# EAGLE design Turnout Decoder V1.1Hall (EAGLE 8.2.2)
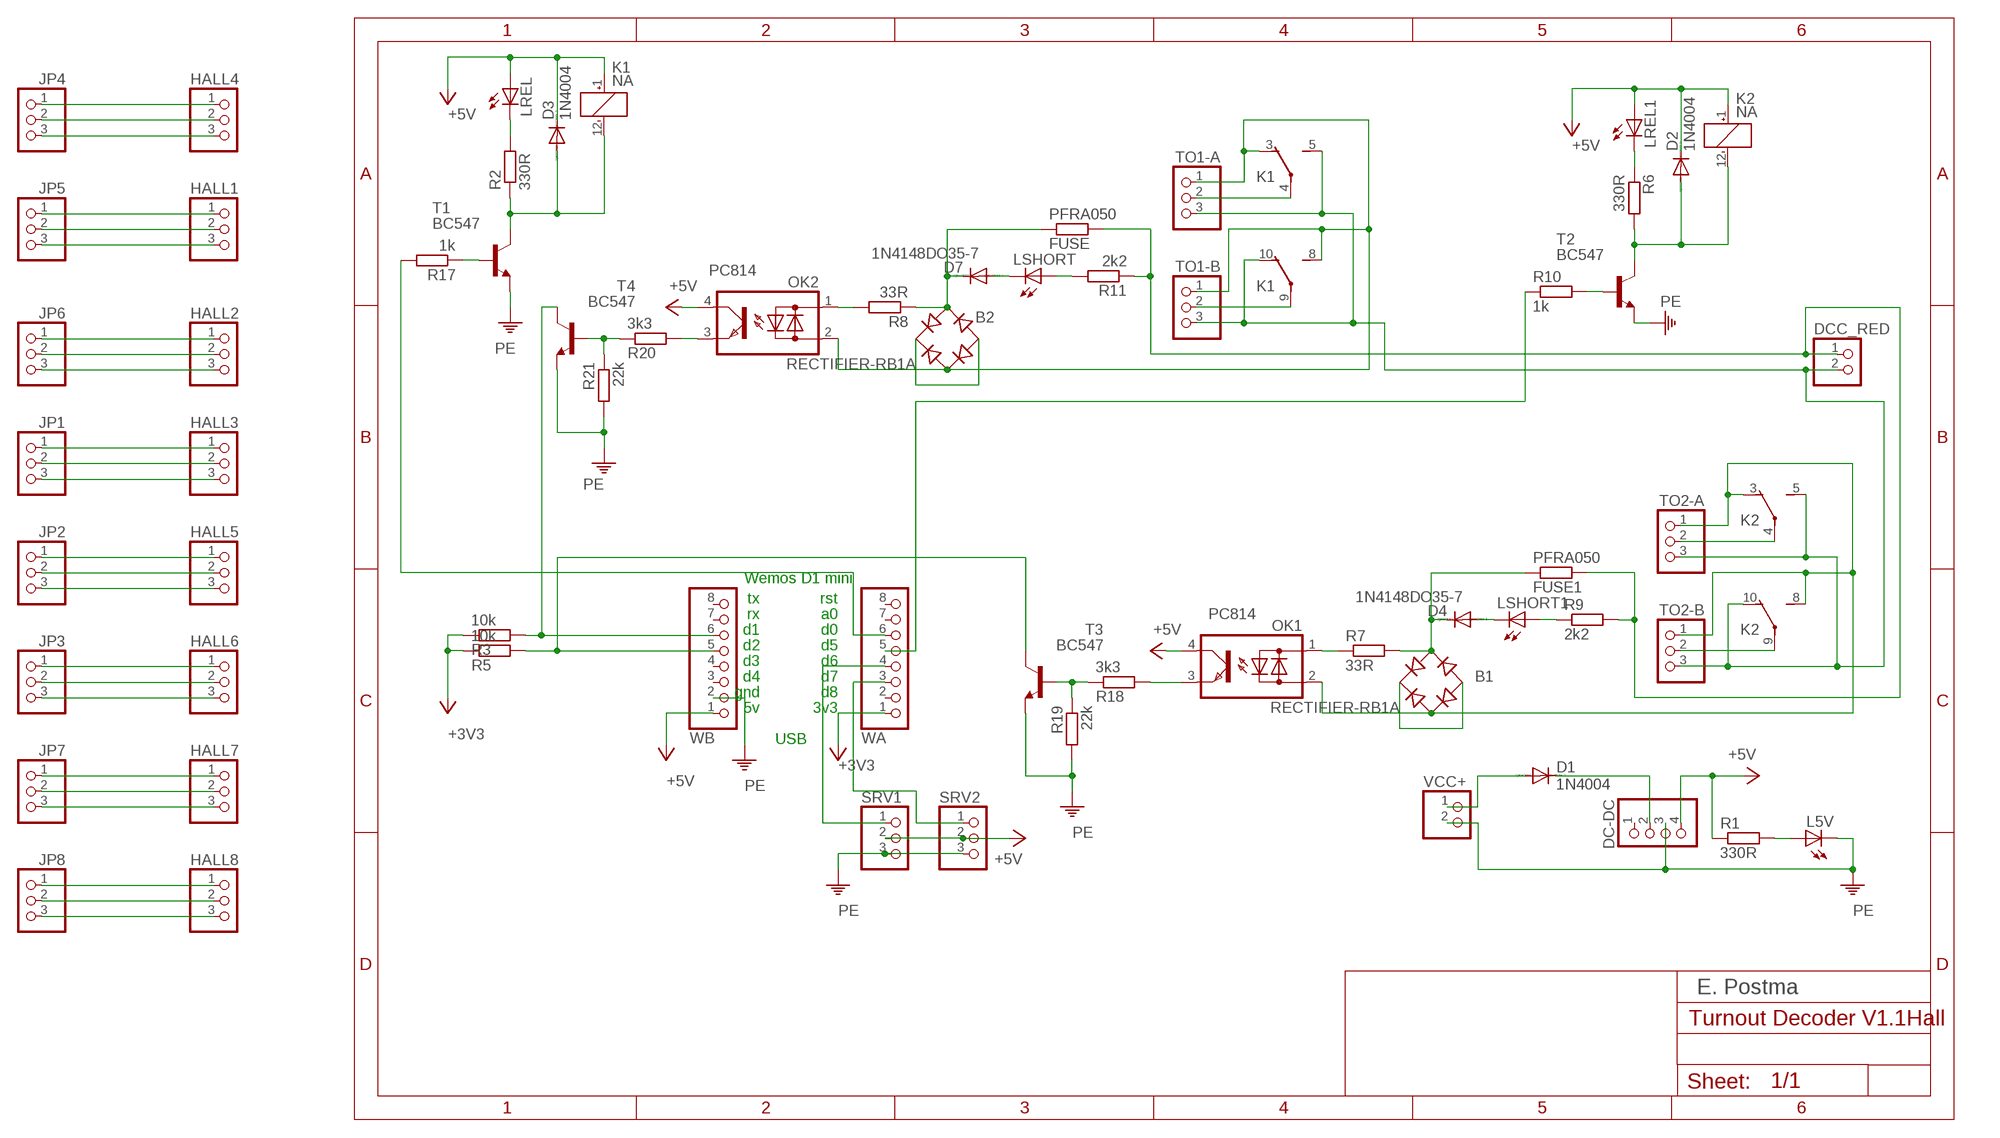
[diagram p0: schematic, sheet 1]

## Parts
B1  RECTIFIER-RB1A  [RB1A]
B2  RECTIFIER-RB1A  [RB1A]
D1  1N4004  [DO41-10]
D2  1N4004  [DO41-10]
D3  1N4004  [DO41-10]
D4  1N4148DO35-7  [DO35-7]
D7  1N4148DO35-7  [DO35-7]
DC-DC  PINHD-1X4  [1X04]
DCC_RED  PINHD-1X2  [1X02]
FUSE  PFRA050  R-EU_0414/5V  [0414V]
FUSE1  PFRA050  R-EU_0414/5V  [0414V]
HALL1  PINHD-1X3  [1X03]
HALL2  PINHD-1X3  [1X03]
HALL3  PINHD-1X3  [1X03]
HALL4  PINHD-1X3  [1X03]
HALL5  PINHD-1X3  [1X03]
HALL6  PINHD-1X3  [1X03]
HALL7  PINHD-1X3  [1X03]
HALL8  PINHD-1X3  [1X03]
JP1  PINHD-1X3  [1X03]
JP2  PINHD-1X3  [1X03]
JP3  PINHD-1X3  [1X03]
JP4  PINHD-1X3  [1X03]
JP5  PINHD-1X3  [1X03]
JP6  PINHD-1X3  [1X03]
JP7  PINHD-1X3  [1X03]
JP8  PINHD-1X3  [1X03]
K1  NA  [NA]
K2  NA  [NA]
L5V  LED3MM  [LED3MM]
LREL  LED3MM  [LED3MM]
LREL1  LED3MM  [LED3MM]
LSHORT  LED3MM  [LED3MM]
LSHORT1  LED3MM  [LED3MM]
OK1  PC814  [DIL04]
OK2  PC814  [DIL04]
R1  330R  R-EU_0207/7  [0207/7]
R2  330R  R-EU_0207/7  [0207/7]
R3  10k  R-EU_0207/7  [0207/7]
R5  10k  R-EU_0207/7  [0207/7]
R6  330R  R-EU_0207/7  [0207/7]
R7  33R  R-EU_0207/7  [0207/7]
R8  33R  R-EU_0207/7  [0207/7]
R9  2k2  R-EU_0207/7  [0207/7]
R10  1k  R-EU_0207/7  [0207/7]
R11  2k2  R-EU_0207/7  [0207/7]
R17  1k  R-EU_0207/7  [0207/7]
R18  3k3  R-EU_0207/7  [0207/7]
R19  22k  R-EU_0207/7  [0207/7]
R20  3k3  R-EU_0207/7  [0207/7]
R21  22k  R-EU_0207/7  [0207/7]
SRV1  PINHD-1X3  [1X03]
SRV2  PINHD-1X3  [1X03]
T1  BC547  [TO92]
T2  BC547  [TO92]
T3  BC547  [TO92]
T4  BC547  [TO92]
TO1-A  PINHD-1X3  [1X03]
TO1-B  PINHD-1X3  [1X03]
TO2-A  PINHD-1X3  [1X03]
TO2-B  PINHD-1X3  [1X03]
VCC+  PINHD-1X2  [1X02]
WA  PINHD-1X8  [1X08]
WB  PINHD-1X8  [1X08]

## Nets
+3V3 [3.3V]: R3.1 R5.1 WA.1
+5V [5V]: D2.C D3.C DC-DC.4 K1.1(1:+) K2.1(1:+) LREL1.A LREL.A OK1.4(C) OK2.4(C) R1.1 SRV1.2 SRV2.2 WB.1
N$1: HALL1.2 JP5.2
N$2: LREL1.K(C) R6.1
N$3 [Rijstroom+]: DCC_RED.1 FUSE1.2 FUSE.2 R9.2 R11.1
N$4 [5V]: D1.A VCC+.1
N$5: OK1.1(AC1) R7.1
N$6: LSHORT1.A R9.1
N$7: D4.A LSHORT1.K(C)
N$8: D2.A K2.12(1:-) R6.2 T2.3(C)
N$9: R10.2 T2.2(B)
N$10 [Rijstroom+]: B1.+ B1.-
N$11: OK1.3(E) R18.2
N$12: LREL.K(C) R2.2
N$13 [Rijstroom+]: K2.4(2:P) TO2-A.2
N$14 [Rijstroom+]: B2.AC2 K1.3(2:O) K1.8(3:S) OK2.2(AC2) TO1-A.1 TO1-B.1
N$15 [Rijstroom-]: K2.9(3:P) TO2-B.2
N$16 [Rijstroom-]: DCC_RED.2 K1.5(2:S) K1.10(3:O) K2.5(2:S) K2.10(3:O) TO1-A.3 TO1-B.3 TO2-A.3 TO2-B.3
N$17: OK2.3(E) R20.2
N$18 [Rijstroom+]: B1.AC2 K2.3(2:O) K2.8(3:S) OK1.2(AC2) TO2-A.1 TO2-B.1
N$19: R3.2 T4.3(C) WB.6
N$20 [Rijstroom+]: B1.AC1 D4.C FUSE1.1 R7.2
N$21: OK2.1(AC1) R8.2
N$22: R5.2 T3.3(C) WB.5
N$23 [Rijstroom+]: B2.AC1 D7.C FUSE.1 R8.1
N$24: HALL1.1 JP5.1
N$25: HALL1.3 JP5.3
N$26 [Rijstroom+]: K1.4(2:P) TO1-A.2
N$27: R18.1 R19.1 T3.2(B)
N$28: R20.1 R21.1 T4.2(B)
N$29: R17.2 WA.6
N$30: HALL2.2 JP6.2
N$31: SRV1.1 WA.4
N$32 [Rijstroom-]: K1.9(3:P) TO1-B.2
N$33: SRV2.1 WA.3
N$34: R10.1 WA.5
N$35: LSHORT.A R11.2
N$36: HALL2.1 JP6.1
N$37: HALL2.3 JP6.3
N$38: HALL3.2 JP1.2
N$39: HALL3.1 JP1.1
N$40: HALL3.3 JP1.3
N$41: D7.A LSHORT.K(C)
N$42 [Rijstroom+]: B2.+ B2.-
N$43: HALL5.2 JP2.2
N$44: HALL5.1 JP2.1
N$45: HALL5.3 JP2.3
N$46: L5V.A R1.2
N$47: HALL6.2 JP3.2
N$48: HALL6.1 JP3.1
N$49: R17.1 T1.2(B)
N$50: D3.A K1.12(1:-) R2.1 T1.3(C)
N$51: HALL6.3 JP3.3
N$52: HALL7.2 JP7.2
N$53: HALL7.1 JP7.1
N$54: HALL7.3 JP7.3
N$55: HALL4.2 JP4.2
N$56: HALL4.3 JP4.3
N$57: HALL4.1 JP4.1
N$58 [5V]: D1.C DC-DC.2
N$59: HALL8.2 JP8.2
N$60: HALL8.1 JP8.1
N$61: HALL8.3 JP8.3
PE [Gnd]: DC-DC.3 L5V.K(C) R19.2 R21.2 SRV1.3 SRV2.3 T1.1(E) T2.1(E) T3.1(E) T4.1(E) VCC+.2 WB.2
Unconnected: DC-DC.1 WA.2 WA.7 WA.8 WB.3 WB.4 WB.7 WB.8

## Notes on the sheet
- Wemos D1 mini
- tx | rst
- rx | a0
- d1 | d0
- d2 | d5
- d3 | d6
- d4 | d7
- gnd | d8
- 5v | 3v3
- USB
- E. Postma

## Library data of the parts
B1 B2 = rectifier:RECTIFIER-: Rectifier
D1-D3 = diode:1N4004: DIODE general purpose rectifier, 1 A
D4 D7 = diode:1N4148: DIODE high speed (Philips)
DC-DC = pinhead:PINHD-1X4: PIN HEADER
DCC_RED VCC+ = pinhead:PINHD-1X2: PIN HEADER
FUSE FUSE1 R1-R3 R5-R11 R17-R21 = resistor:R-EU_: RESISTOR, European symbol
HALL1-HALL8 JP1-JP8 SRV1 SRV2 TO1-A TO1-B TO2-A TO2-B = pinhead:PINHD-1X3: PIN HEADER
K1 K2 = relay:NA: RELAY; OC_FARNELL: unknown; OC_NEWARK: unknown
L5V LREL LREL1 LSHORT LSHORT1 = led:LED: LED OSRAM: - CHIPLED LG R971, LG N971, LY N971, LG Q971, LY Q971, LO R971, LY R971 LH N974, LH R974 LS Q976, LO Q976, LY Q976 LO Q996 - Hyper CHIPLED LW Q18S LB Q993, LB Q99A, LB R99A - SideLED LS A670, LO A670, LY A670, LG A670, LP A670 LB A673, LV A673, LT A673, LW A673 LH A674 LY A675 LS A676, LA A676, LO A676, LY A676, LW A676 LS A679, LY A679, LG A679 - Hyper Micro SIDELED® LS Y876, LA Y876, LO Y876, LY Y876 LT Y87S - SmartLED LW L88C, LW L88S LB L89C, LB L89S, LG L890 LS L89K, LO L89K, LY L89K LS L896, LA L896, LO L896, LY L896 - TOPLED LS T670, LO T670, LY T670, LG T670, LP T670 LSG T670, LSP T670, LSY T670, LOP T670, LYG T670 LG T671, LOG T671, LSG T671 LB T673, LV T673, LT T673, LW T673 LH T674 LS T676, LA T676, LO T676, LY T676, LB T676, LH T676, LSB T676, LW T676 LB T67C, LV T67C, LT T67C, LS T67K, LO T67K, LY T67K, LW E67C LS E67B, LA E67B, LO E67B, LY E67B, LB E67C, LV E67C, LT E67C LW T67C LS T679, LY T679, LG T679 LS T770, LO T770, LY T770, LG T770, LP T770 LB T773, LV T773, LT T773, LW T773 LH T774 LS E675, LA E675, LY E675, LS T675 LS T776, LA T776, LO T776, LY T776, LB T776 LHGB T686 LT T68C, LB T68C - Hyper Mini TOPLED® LB M676 - Mini TOPLED Santana® LG M470 LS M47K, LO M47K, LY M47K Source: http://www.osram.convergy.de LUXEON: - LUMILED® LXK2-PW12-R00, LXK2-PW12-S00, LXK2-PW14-U00, LXK2-PW14-V00 LXK2-PM12-R00, LXK2-PM12-S00, LXK2-PM14-U00 LXK2-PE12-Q00, LXK2-PE12-R00, LXK2-PE12-S00, LXK2-PE14-T00, LXK2-PE14-U00 LXK2-PB12-K00, LXK2-PB12-L00, LXK2-PB12-M00, LXK2-PB14-N00, LXK2-PB14-P00, LXK2-PB14-Q00 LXK2-PR12-L00, LXK2-PR12-M00, LXK2-PR14-Q00, LXK2-PR14-R00 LXK2-PD12-Q00, LXK2-PD12-R00, LXK2-PD12-S00 LXK2-PH12-R00, LXK2-PH12-S00 LXK2-PL12-P00, LXK2-PL12-Q00, LXK2-PL12-R00 Source: www.luxeon.com KINGBRIGHT: KA-3528ASYC Source: www.kingbright.com
OK1 OK2 = optocoupler:PC814: SHARP OPTO COUPLER; OC_FARNELL: 9707662; OC_NEWARK: unknown
T1-T4 = transistor:BC547: NPN TRANSISTOR
WA WB = pinhead:PINHD-1X8: PIN HEADER

## Net classes
0 default: width 0.635 mm, clearance 0.254 mm
1 5V: width 0.762 mm, clearance 0.254 mm
2 Gnd: width 0.762 mm, clearance 0.254 mm
3 Extra: width 1.016 mm, clearance 0.254 mm
4 Rijstroom+: width 1.016 mm, clearance 0.254 mm
5 3.3V: width 0.508 mm, clearance 0.254 mm
6 Rijstroom-: width 1.016 mm, clearance 0.254 mm

## Board
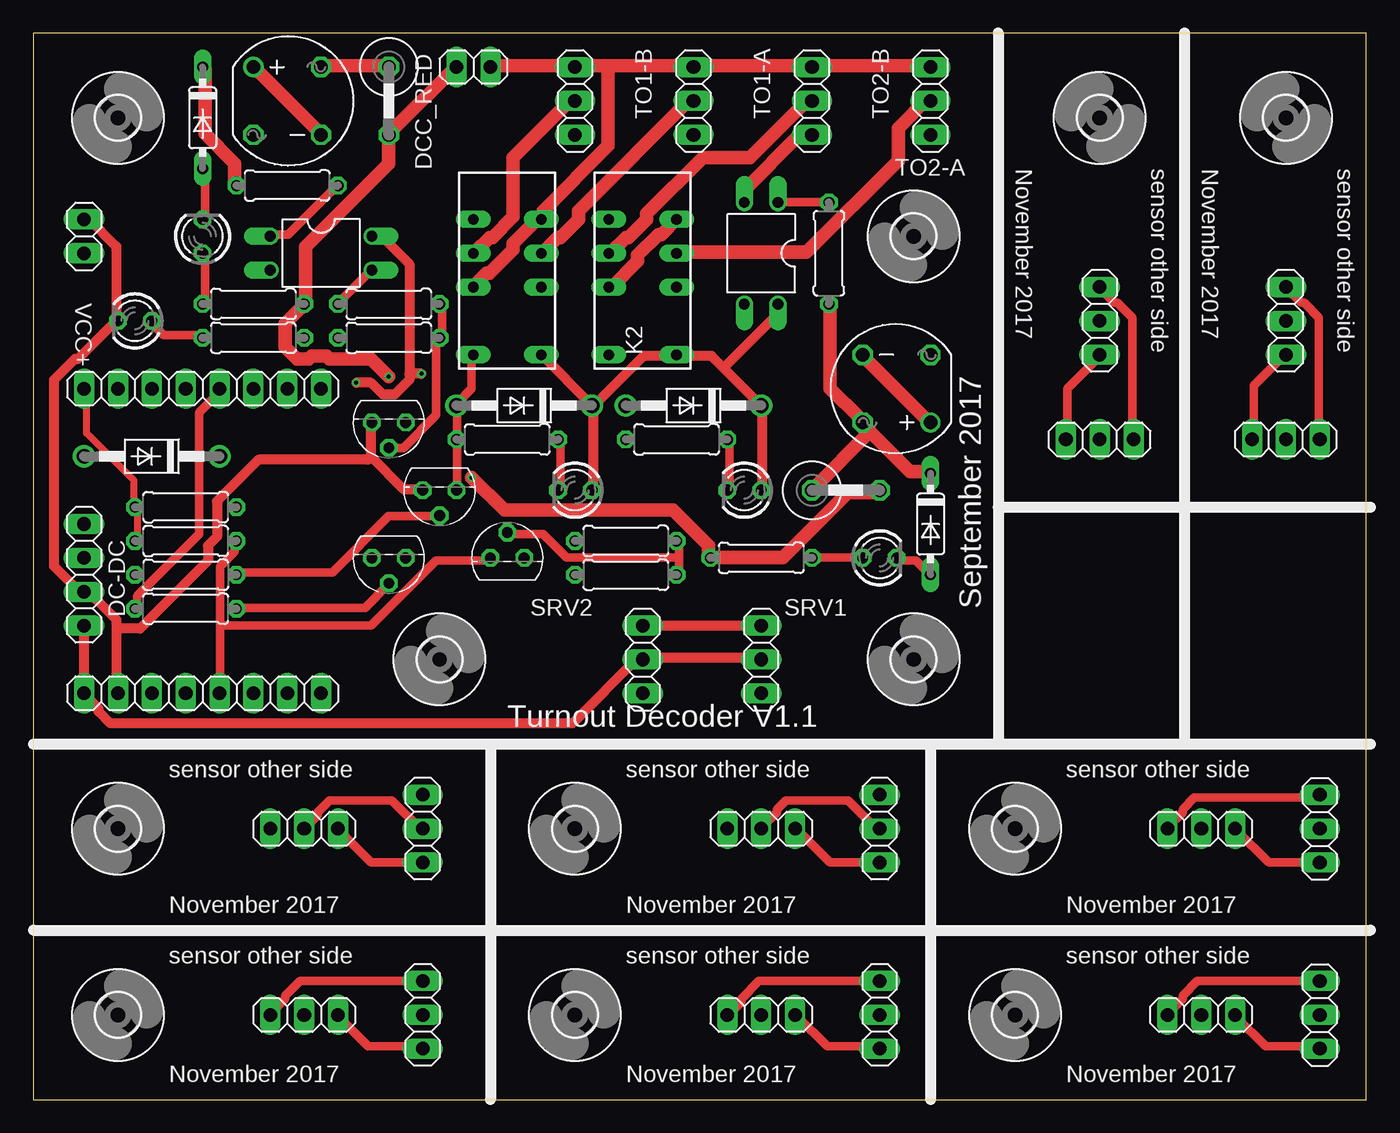
[diagram p1: board, top side]
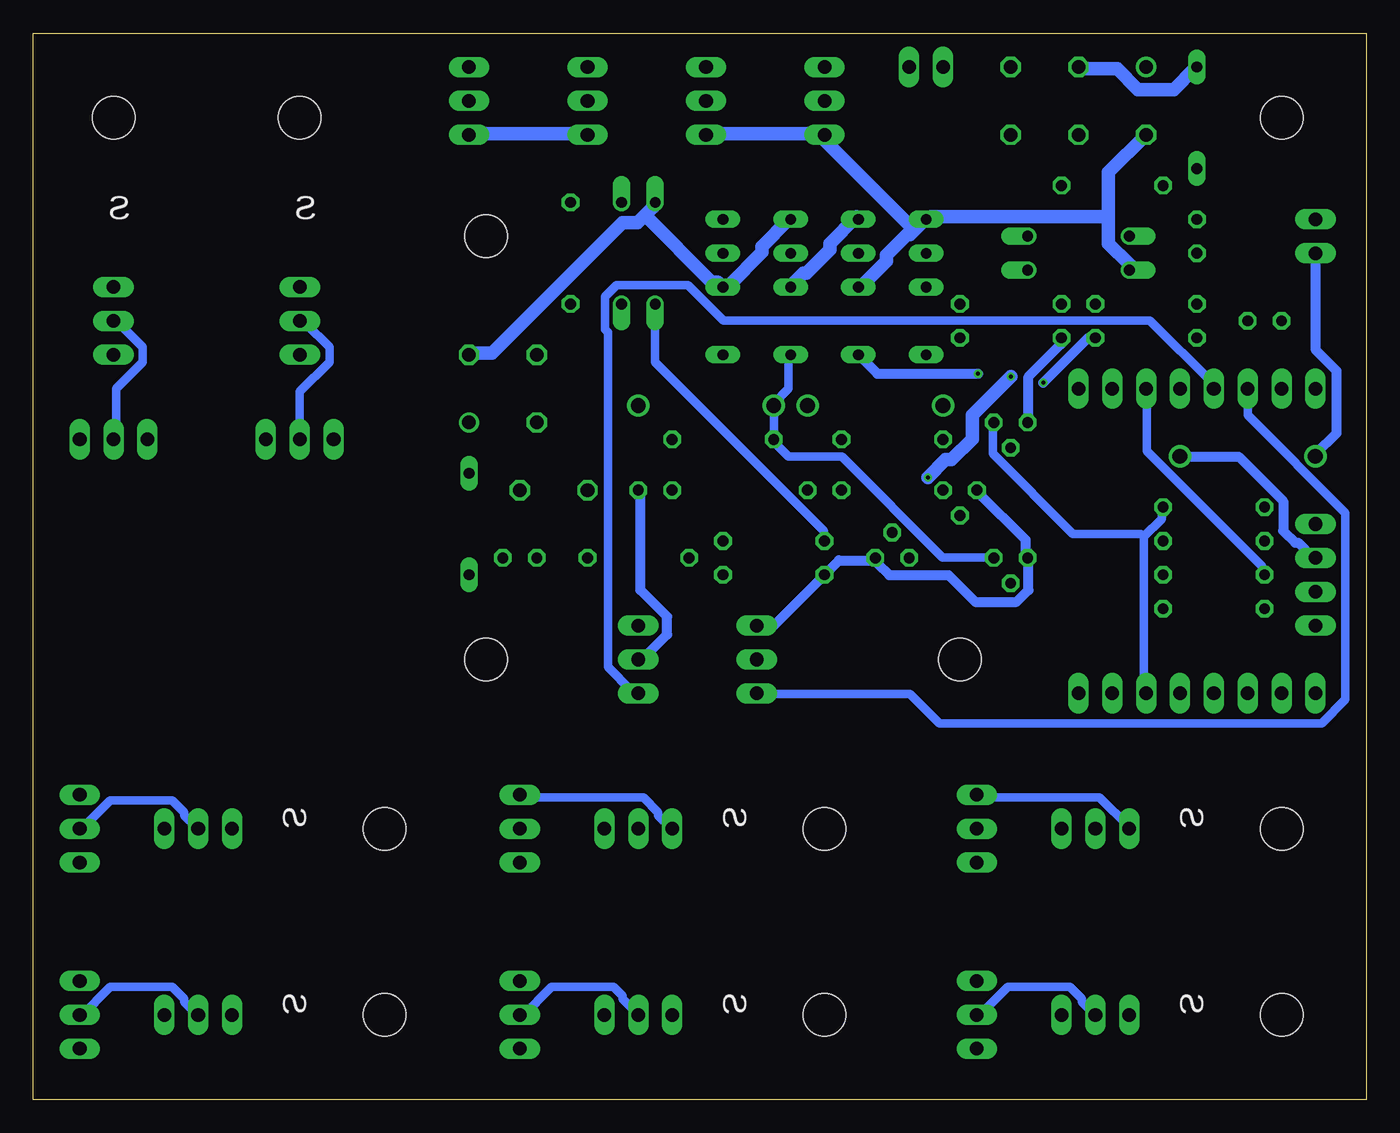
[diagram p2: board, bottom side, seen from below]

Size 100 x 80 mm. Coordinates in mm from the lower left corner, seen from the top.
Outline: 0,0 100,0 100,80 0,80 0,0
Copper layers (1*16): Top 0.035mm / dielectric 1.5mm / Bottom 0.035mm
Design rules "NOA Eagle Rule 2016-06-12": minimum track width 6mil, minimum drill 0.3mm, track to track 6mil, track to pad 6mil, pad to pad 6mil, via to via 6mil, smd to smd 0mil, copper to edge 0.4mm, drill to drill 10mil, minimum pad ring 10mil, minimum via ring 6mil, stop-mask expansion 2mil, vias tented up to drill 25mil, thermal gap 10mil
tRestrict: 1 lines
bRestrict: 1 lines

### Footprints (pad centres in the part's own frame; a part is rotated, then mirrored left to right if it is on the bottom)
RB1A = drill 1.016: + -2.54,2.54 | drill 1.016 octagon: - 2.54,-2.54; AC1 2.54,2.54; AC2 -2.54,-2.54
DO41-10 = drill 1.118: A 5.08,0; C -5.08,0
DO35-7 = drill 0.813 long: A 3.81,0; C -3.81,0
1X04 = drill 1.016 long: 1 -3.81,0; 2 -1.27,0; 3 1.27,0; 4 3.81,0
1X02 = drill 1.016 long: 1 -1.27,0; 2 1.27,0
0414V = drill 1.016 octagon: 1 -2.54,0; 2 2.54,0
1X03 = drill 1.016 long: 1 -2.54,0; 2 0,0; 3 2.54,0
NA = drill 0.8 long: 1 -6.35,-2.54; 3 -1.27,-2.54; 4 1.27,-2.54; 5 3.81,-2.54; 8 3.81,2.54; 9 1.27,2.54; 10 -1.27,2.54; 12 -6.35,2.54
LED3MM = drill 0.813 octagon: A -1.27,0; K 1.27,0
DIL04 = drill 0.813 offset: 1 -1.27,-3.81; 2 1.27,-3.81; 3 1.27,3.81; 4 -1.27,3.81
0207/7 = drill 0.813 octagon: 1 -3.81,0; 2 3.81,0
TO92 = drill 0.813 octagon: 1 1.27,0; 2 0,1.905; 3 -1.27,0
3,2 = hole 3.2: 0,0
1X08 = drill 1.016 long: 1 -8.89,0; 2 -6.35,0; 3 -3.81,0; 4 -1.27,0; 5 1.27,0; 6 3.81,0; 7 6.35,0; 8 8.89,0

### Placement (x,y rotation side)
B1  64.77,53.34 180 top
B2  19.05,74.93 0 top
D1  8.89,48.26 180 top
D2  49.53,52.07 180 top
D3  36.83,52.07 180 top
D4  67.31,43.18 270 top
D7  12.7,73.66 270 top
DC-DC  3.81,39.37 270 top
DCC_RED  33.02,77.47 0 top
FUSE  26.67,74.93 270 top
FUSE1  60.96,45.72 0 top
HALL1  20.32,20.32 0 top
HALL2  93.98,58.42 270 top
HALL3  20.32,6.35 0 top
HALL4  80.01,58.42 270 top
HALL5  54.61,20.32 0 top
HALL6  54.61,6.35 0 top
HALL7  87.63,20.32 180 top
HALL8  87.63,6.35 180 top
JP1  29.21,6.35 270 top
JP2  63.5,20.32 270 top
JP3  63.5,6.35 270 top
JP4  80.01,49.53 180 top
JP5  29.21,20.32 270 top
JP6  93.98,49.53 180 top
JP7  96.52,20.32 90 top
JP8  96.52,6.35 90 top
K1  35.56,62.23 90 top
K2  45.72,62.23 90 top
L5V  7.62,58.42 180 top
LREL  40.64,45.72 180 top
LREL1  53.34,45.72 180 top
LSHORT  12.7,64.77 90 top
LSHORT1  63.5,40.64 0 top
OK1  54.61,63.5 180 top
OK2  21.59,63.5 270 top
R1  16.51,57.15 180 top
R2  35.56,49.53 0 top
R3  11.43,44.45 0 top
R5  11.43,41.91 0 top
R6  48.26,49.53 180 top
R7  59.69,63.5 270 top
R8  19.05,68.58 0 top
R9  54.61,40.64 180 top
R10  11.43,36.83 0 top
R11  16.51,59.69 180 top
R17  11.43,39.37 180 top
R18  44.45,41.91 180 top
R19  44.45,39.37 180 top
R20  26.67,59.69 180 top
R21  26.67,57.15 180 top
SRV1  54.61,33.02 90 top
SRV2  45.72,33.02 90 top
T1  30.48,45.72 180 top
T2  26.67,40.64 180 top
T3  35.56,40.64 0 top
T4  26.67,50.8 180 top
TO1-A  49.53,74.93 90 top
TO1-B  40.64,74.93 90 top
TO2-A  67.31,74.93 90 top
TO2-B  58.42,74.93 90 top
U$1  [3,2]  6.35,73.66 0 top
U$2  [3,2]  66.04,64.77 0 top
U$3  [3,2]  30.48,33.02 0 top
U$4  [3,2]  66.04,33.02 0 top
U$5  [3,2]  73.66,20.32 0 top
U$6  [3,2]  6.35,20.32 0 top
U$7  [3,2]  73.66,6.35 0 top
U$11  [3,2]  80.01,73.66 270 top
U$12  [3,2]  93.98,73.66 270 top
U$14  [3,2]  6.35,6.35 0 top
U$15  [3,2]  40.64,20.32 0 top
U$16  [3,2]  40.64,6.35 0 top
VCC+  3.81,64.77 90 top
WA  12.7,53.34 0 top
WB  12.7,30.48 0 top

### Tracks (layer width: path | path; a pad name or v marks a point on that pad's centre or on a via)
+3V3
  Top 0.508: R5.1 7.78,42.01 7.78,44.45 R3.1 7.56,44.67 7.56,46.45 4,50.01 4,53.34 WA.1
+5V  (via drill 0.3)
  Top 0.762: v24.23,53.78 25.34,53.78 26.23,52.9 27.11,52.9 28.23,54.01 28.23,54.45 | 28.23,54.45 28.23,62.67 26.23,64.67 25.56,64.67 OK2.4 | K1.1 38.23,55.78 41.78,52.23 D3.C | LREL.A 42.01,45.78 42.01,51.78 D3.C | 51.78,54.9 D2.C 54.67,51.78 54.67,45.78 LREL1.A | 51.78,54.9 50.9,55.78 48.45,55.78 K2.1 48.01,55.78 45.78,55.78 42.23,52.23 D3.C | 51.78,54.9 55.78,58.9 55.78,59.56 OK1.4 | v29.11,54.45 28.23,54.45 | DC-DC.4 3.78,35.56 3.78,30.67 WB.1 4,30.23 4.89,29.34 4.89,29.11 5.78,28.23 40.45,28.23 45.34,33.12 SRV2.2 45.78,33.12 54.45,33.12 SRV1.2
  Bottom 0.762: v24.23,53.78 20.89,57.12 20.45,57.12 R1.1 | v29.11,54.45 36.67,54.45 K1.1 | LREL1.A 54.45,45.56 54.45,38.23 52.45,36.23 52.45,34.89 54.45,32.89 SRV1.2
N$1
  Top 0.635: HALL1.2 21.34,21.34 21.34,21.56 22.23,22.45 26.89,22.45 29.11,20.23 JP5.2
N$2
  Top 0.635: LREL1.K 52.23,45.78 52.23,49.34 R6.1
N$3  (via drill 0.3)
  Top 1.016: FUSE1.2 63.34,45.56 61.12,45.56 56.23,40.67 50.9,40.67 R9.2 50.67,41.12 50.67,41.56 48.01,44.23 35.34,44.23 v32.89,46.67 | DCC_RED.1 31.56,77.34 26.89,72.68 FUSE.2 26.67,70.23 20.45,64.01 20.45,59.78 R11.1 20,59.34 18.89,58.23 18.89,56.45 19.78,55.56 20.67,55.56 20.89,55.78 22,55.78 22.23,55.56 25.34,55.56 v26.67,54.23
  Bottom 1.016: v32.89,46.67 31.56,48.01 31.11,48.01 29.56,49.56 29.56,51.34 v26.67,54.23
N$4
  Bottom 0.762: VCC+.1 3.78,63.34 3.78,56.23 2.22,54.67 2.22,50.01 3.78,48.45 D1.A
N$5
  Top 0.635: OK1.1 56.01,67.34 59.56,67.34 R7.1
N$6
  Top 0.635: R9.1 58.45,40.67 62.23,40.67 LSHORT1.A
N$7
  Top 0.635: D4.A 66.23,40.45 64.9,40.45 LSHORT1.K
N$8
  Bottom 0.635: K2.12 43.34,55.78 43.34,53.34 44.45,52.23 D2.A R6.2 44.45,49.34 43.34,48.23 39.34,48.23 31.78,40.67 28,40.67 T2.3
N$9
  Top 0.635: R10.2 15.34,36.89 24.89,36.89 26.67,38.67 T2.2
N$10
  Top 1.016: B1.- 62.23,55.78 67.12,50.9 B1.+
N$11
  Bottom 0.635: OK1.3 53.34,55.34 40.67,42.67 40.67,42.01 R18.2
N$12
  Top 0.635: LREL.K 39.56,45.78 39.56,49.34 R2.2
N$13
  Top 1.016: K2.4 48.45,63.56 58.01,63.56 64.9,70.45 64.9,72.9 67.12,75.12 TO2-A.2
N$14
  Bottom 1.016: OK2.2 17.78,62.67 19.34,64.23 19.34,66.23 | 19.34,66.23 19.34,69.56 B2.AC2 | 33.89,65.23 34.23,64.9 34.45,64.9 36.01,63.34 36.01,62.9 38.01,60.9 K1.3 | 33.89,65.23 33.12,66.01 K1.8 32.67,66.23 19.34,66.23 | TO1-A.1 49.34,72.45 40.67,72.45 TO1-B.1 40.67,72.01 33.89,65.23
N$15
  Top 1.016: K2.9 43.34,63.56 44.45,64.67 44.67,64.67 46.01,66.01 46.01,66.45 50.23,70.67 53.78,70.67 58.23,75.12 TO2-B.2
N$16
  Top 1.016: K1.10 33.12,61.12 34,62.01 34.23,62.01 36.01,63.79 36.01,64.23 38.01,66.23 K1.5 38.23,66.67 43.12,71.56 43.12,77.56 | K2.5 47.12,64.9 46.9,64.9 45.34,63.34 45.34,62.9 43.34,60.9 K2.10 | DCC_RED.2 34.45,77.56 40.45,77.56 TO1-B.3 41.12,77.56 43.12,77.56 | 43.12,77.56 49.34,77.56 TO1-A.3 50.01,77.56 58.23,77.56 TO2-B.3 58.9,77.56 67.12,77.56 TO2-A.3
  Bottom 1.016: K2.10 43.12,61.12 42.23,62.01 42.01,62.01 40.23,63.79 40.23,64.23 38.23,66.23 K1.5
N$17
  Top 0.635: R20.2 22.89,59.78 25.34,62.23 OK2.3
N$18
  Top 1.016: OK1.2 53.34,68.23 57.34,72.23 58.23,72.23 TO2-B.1
  Bottom 1.016: K2.8 43.34,66.01 45.34,64.01 45.34,63.56 47.78,61.12 48.23,61.12 K2.3 48.67,61.34 49.12,61.34 54.12,66.34 | 54.12,66.34 53.34,67.12 OK1.2 | 54.12,66.34 54.67,65.79 55.78,65.79 65.56,56.01 67.12,56.01 B1.AC2 | TO2-A.1 67.12,72.45 58.45,72.45 TO2-B.1
N$19
  Bottom 0.635: 16.67,42.23 15.34,43.56 15.34,44.45 R3.2 | 16.67,42.23 16.67,30.67 WB.6 | T4.3 28,50.67 28,48.45 22,42.45 16.89,42.45 16.67,42.23
N$20
  Top 1.016: 62.79,50.12 62.23,50.67 B1.AC1 62.01,51.12 59.78,53.34 59.78,59.56 R7.2 | 62.79,50.12 65.79,47.12 67.12,47.12 D4.C | 62.79,50.12 58.45,45.78 FUSE1.1
N$21
  Top 0.635: OK2.1 17.78,64.9 19.11,64.9 22.67,68.45 R8.2
N$22
  Top 0.635: 14,35.56 14,30.67 WB.5 | 14,35.56 14,40.01 15.11,41.12 15.11,41.78 R5.2 | 14,35.56 25.34,35.56 30.23,40.45 34.23,40.45 T3.3
N$23
  Top 1.016: B2.AC1 21.78,77.56 26.67,77.56 FUSE.1 | D7.C 12.89,77.34 12.89,72.45 15.11,70.23 15.11,68.67 R8.1
  Bottom 1.016: B2.AC1 21.56,77.34 18.67,77.34 17.11,75.79 14.45,75.79 12.89,77.34 D7.C
N$24
  Bottom 0.635: HALL1.1 17.78,20.45 20,22.67 29.11,22.67 JP5.1
N$25
  Top 0.635: JP5.3 25.34,17.78 22.89,20.23 HALL1.3
N$26
  Top 1.016: K1.4 38.23,63.56 39.34,64.67 39.56,64.67 40.89,66.01 40.89,66.67 49.34,75.12 TO1-A.2
N$27
  Top 0.635: 48.45,40.67 48.45,41.78 R18.1 | 48.45,40.67 48.45,39.56 R19.1 | 48.45,40.67 40.01,40.67 38.23,42.45 35.56,42.45 T3.2
N$28
  Top 0.635: T4.2 27.78,48.9 30.23,51.34 30.23,56.9 R21.1 30.67,57.34 30.67,59.56 R20.1
N$29
  Bottom 0.635: R17.2 7.78,39.56 7.78,40.01 16.45,48.67 16.45,53.34 WA.6
N$30
  Bottom 0.635: JP6.2 93.79,49.56 93.79,53.34 91.79,55.34 91.79,56.45 93.79,58.45 HALL2.2
N$31
  Bottom 0.635: SRV1.1 54.67,30.67 55.12,30.67 56.9,32.45 56.9,57.56 57.12,57.78 57.12,60.23 56.23,61.12 50.9,61.12 48.23,58.45 16.22,58.45 11.56,53.78 11.56,53.34 WA.4
N$32
  Top 1.016: K1.9 33.12,63.56 34.23,64.67 34.45,64.67 36.01,66.23 36.01,70.67 40.45,75.12 TO1-B.2
N$33
  Bottom 0.635: WA.3 8.89,51.34 1.56,44.01 1.56,30 3.33,28.23 32,28.23 34.23,30.45 45.56,30.45 SRV2.1
N$34
  Top 0.635: R10.1 7.78,36.89 7.78,37.78 12.45,42.45 12.45,51.56 13.78,52.9 13.78,53.34 WA.5
N$35
  Top 0.635: R11.2 12.89,59.78 12.89,63.34 LSHORT.A
N$36
  Top 0.635: HALL2.1 94.01,60.9 95.12,59.78 95.34,59.78 96.46,58.67 96.46,49.56 JP6.1
N$37
  Top 0.635: JP6.3 91.57,49.56 91.57,53.56 93.79,55.78 HALL2.3
N$38
  Bottom 0.635: HALL3.2 20.45,6.45 21.34,7.33 21.34,7.56 22.23,8.45 26.89,8.45 29.11,6.22 JP1.2
N$39
  Top 0.635: JP1.1 20,8.89 18.89,7.78 18.89,7.56 17.78,6.45 HALL3.1
N$40
  Top 0.635: JP1.3 29.11,4 25.11,4 22.89,6.22 HALL3.3
N$41
  Top 0.635: LSHORT.K 12.89,66.23 12.89,69.79 D7.A
N$42
  Top 1.016: B2.- 21.56,72.45 16.67,77.34 B2.+
N$43
  Top 0.635: HALL5.2 54.67,20.45 55.78,21.56 55.78,21.78 56.45,22.45 61.12,22.45 63.34,20.23 JP2.2
N$44
  Bottom 0.635: HALL5.1 52.23,20.45 53.12,21.34 53.12,21.56 54.23,22.67 63.34,22.67 JP2.1
N$45
  Top 0.635: JP2.3 59.78,17.78 57.34,20.23 HALL5.3
N$46
  Top 0.635: R1.2 12.67,57.34 9.78,57.34 8.89,58.23 L5V.A
N$47
  Bottom 0.635: HALL6.2 54.67,6.45 55.78,7.56 55.78,7.78 56.45,8.45 61.12,8.45 63.34,6.22 JP3.2
N$48
  Top 0.635: JP3.1 54.45,8.89 53.12,7.56 53.12,7.33 52.23,6.45 HALL6.1
N$49
  Top 0.635: R17.1 15.34,39.56 22.45,39.56 26.67,43.78 30.45,43.78 T1.2
N$50
  Top 0.635: T1.3 31.78,45.78 31.78,49.34 R2.1 31.78,49.78 31.78,51.78 D3.A 31.78,52.23 32.89,53.34 32.89,55.78 K1.12
N$51
  Top 0.635: JP3.3 63.34,4 59.56,4 57.34,6.22 HALL6.3
N$52
  Bottom 0.635: HALL7.2 87.79,20.45 88.68,21.34 88.68,21.56 89.57,22.45 94.23,22.45 96.46,20.23 JP7.2
N$53
  Top 0.635: JP7.1 92.68,17.78 90.23,20.23 HALL7.1
N$54
  Top 0.635: HALL7.3 85.12,20.45 86.23,21.56 86.23,21.78 87.12,22.67 96.46,22.67 JP7.3
N$55
  Bottom 0.635: JP4.2 80.01,53.12 77.79,55.34 77.79,56.45 79.57,58.23 80.01,58.23 HALL4.2
N$56
  Top 0.635: JP4.3 77.56,49.56 77.56,53.34 80.01,55.78 HALL4.3
N$57
  Top 0.635: HALL4.1 80.01,60.9 81.12,59.78 81.34,59.78 82.45,58.67 82.45,49.56 JP4.1
N$58
  Bottom 0.762: DC-DC.2 4,40.67 5.11,41.78 5.33,41.78 6.22,42.67 6.22,44.9 9.56,48.23 13.78,48.23 D1.C
N$59
  Bottom 0.635: HALL8.2 87.79,6.45 88.68,7.33 88.68,7.56 89.57,8.45 94.23,8.45 96.46,6.22 JP8.2
N$60
  Top 0.635: JP8.1 96.46,4 92.46,4 90.23,6.22 HALL8.1
N$61
  Top 0.635: JP8.3 87.34,8.89 86.23,7.78 86.23,7.56 85.12,6.45 HALL8.3
PE
  Top 0.762: VCC+.2 4,66.23 6.22,64.01 6.22,58.45 L5V.K 6,58.23 3.33,55.56 3.11,55.56 1.56,54.01 1.56,40.01 3.56,38.01 DC-DC.3 4,38.23 6.22,36.01 6.22,35.34 | 6.22,35.34 6.22,30.67 WB.2 | 25.34,48.23 25.34,50.67 T4.1 | 25.34,48.23 27.78,45.78 29.11,45.78 T1.1 | SRV2.3 SRV1.3 | 6.22,35.34 8,35.34 13.11,40.45 13.11,41.56 13.78,42.23 13.78,44.9 16.89,48.01 25.11,48.01 25.34,48.23
  Bottom 0.762: R21.2 22.89,57.12 22.89,56.67 25.34,54.23 25.34,50.9 T4.1 | T1.1 29.11,45.56 25.56,42.01 25.56,40.67 T2.1 25.34,40.45 25.34,38.23 26.23,37.34 29.34,37.34 31.34,39.34 35.78,39.34 36.67,40.23 T3.1 36.89,40.45 39.56,40.45 R19.2 44.45,35.56 SRV2.3

### Text on the board
tNames: November 2017 | sensor other side | November 2017 | sensor other side | September 2017 | Turnout Decoder V1.1 | sensor other side | sensor other side | sensor other side | November 2017 | November 2017 | November 2017 | sensor other side | sensor other side | sensor other side | November 2017 | November 2017 | November 2017
bNames: S | S | S | S | S | S | S | S